# Altium schematic sheet controller.SchDoc: LV Microcontroller
size A4; Author: Samer Kilani; CompanyName: UCL; DrawnBy: Samer Kilani; Engineer: Samer Kilani; DocumentNumber: 2; Revision: 2.0; SheetNumber: 2; SheetTotal: 3
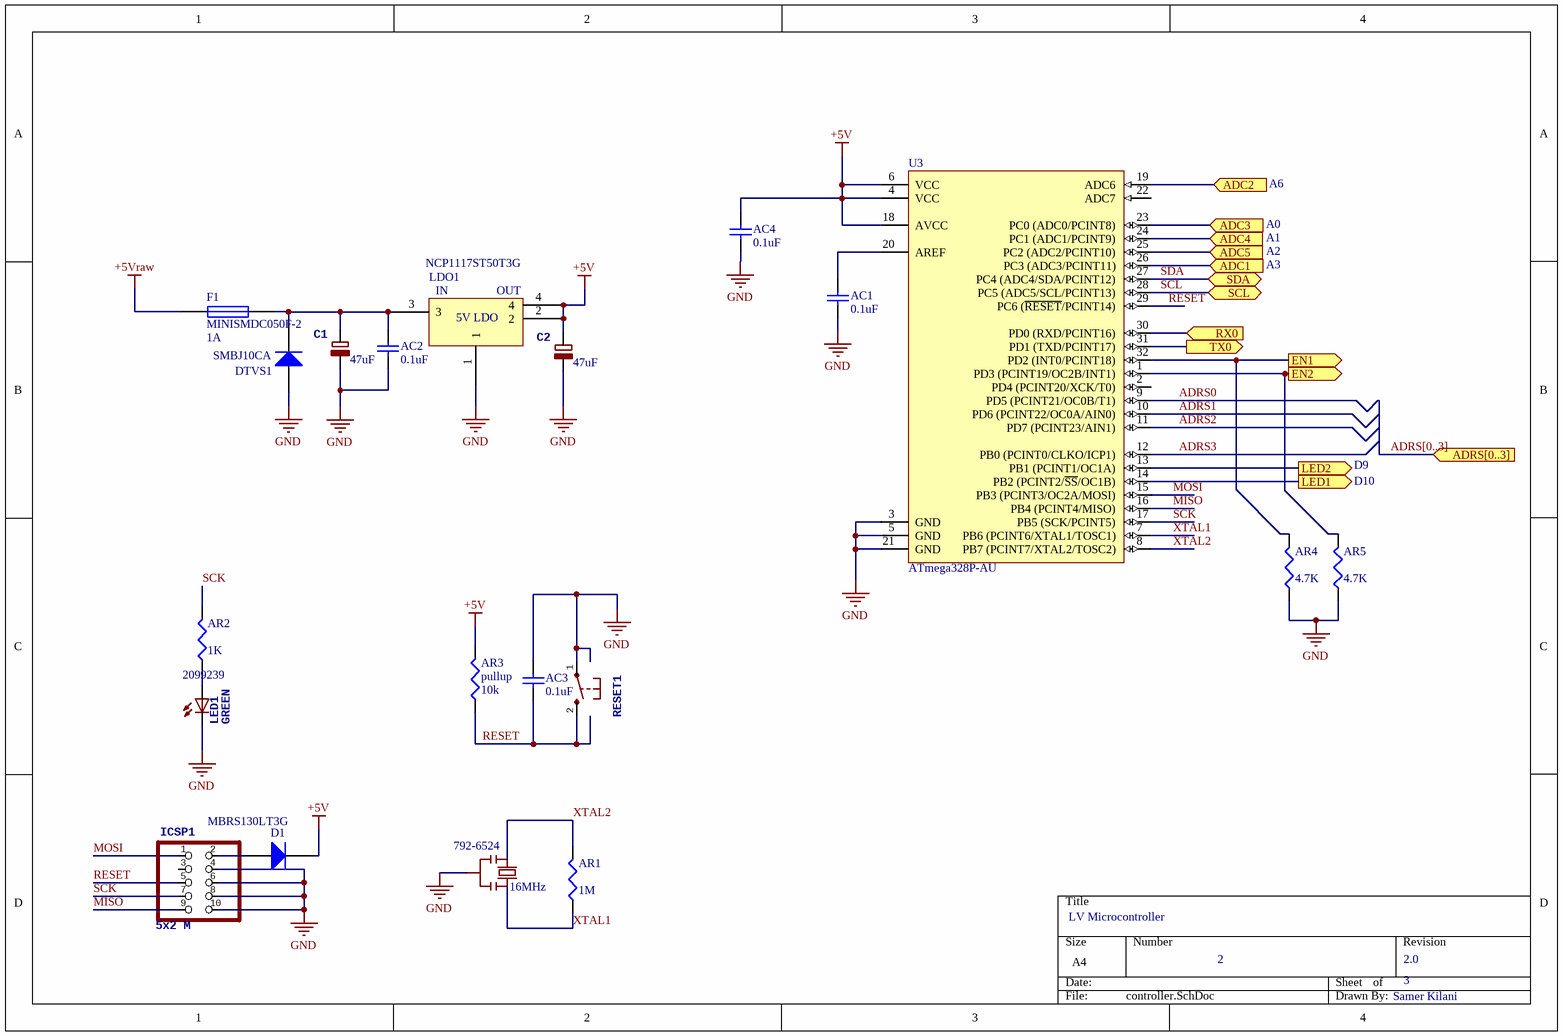
[diagram p0: controller.SchDoc]

## Parts
AC1  value 0.1uF  [1608[0603]]  (hidden comment: Cap Semi)
AC2  value 0.1uF  [1608[0603]]  (hidden comment: Cap Semi)
AC3  value 0.1uF  [1608[0603]]  (hidden comment: Cap Semi)
AC4  value 0.1uF  [1608[0603]]  (hidden comment: Cap Semi)
AR1  value 1M  [J1-0603]
AR2  value 1K  [J1-0603]
AR3  pullup  value 10k  [J1-0603]
AR4  value 4.7K  [J1-0603]
AR5  value 4.7K  [J1-0603]
C1  value 47uF  [PANASONIC_D]
C2  value 47uF  [PANASONIC_D]
D1  MBRS130LT3G  [SMB-403A]
DTVS1  SMBJ10CA  [DO-214AA]
F1  MINISMDC050F-2  Tripping current: 1A  [MF-MSMF1]
ICSP1  5x2 M  [2X05]
LDO1  PartNo: NCP1117ST50T3G  [SOT223]  (hidden comment: LDO_5V)
LED1  GREEN  Supplier Part Number 1: 2099239  [CHIP-LED0805]
RESET1  PB_RST  [1-1825027-4]  (value not drawn)
U3  ATmega328P-AU  [32A_N]
Y1  Supplier Part Number 1: 792-6524  [RESONATOR]

## Ports
ADC1 (in), ADC2 (in), ADC3 (in), ADC4 (in), ADC5 (in), ADRS[0..3] (in), EN1 (out), EN2 (out), LED1 (out), LED2 (out), RX0 (in), SCL (bidir), SDA (bidir), TX0 (out)

## Nets
+5V: AC4.2 AR3.2 C2.1 D1.1(K) LDO1.2 LDO1.4 U3.4(VCC) U3.6(VCC) U3.18(AVCC)
+5Vraw: F1.1
GND: AC1.1 AC2.1 AC3.2 AC4.1 AR4.1 AR5.1 C1.2 C2.2 DTVS1.2(A) ICSP1.4 ICSP1.6 ICSP1.8 ICSP1.10 LDO1.1 LED1.C RESET1.1 U3.3(GND) U3.5(GND) U3.21(GND) Y1.2
ADC1: U3.26(PC3_(ADC3/PCINT11)) ; port ADC1
ADC2: U3.19(ADC6) ; port ADC2
ADC3: U3.23(PC0_(ADC0/PCINT8)) ; port ADC3
ADC4: U3.24(PC1_(ADC1/PCINT9)) ; port ADC4
ADC5: U3.25(PC2_(ADC2/PCINT10)) ; port ADC5
ADRS0: U3.9(PD5_(PCINT21/OC0B/T1))
ADRS1: U3.10(PD6_(PCINT22/OC0A/AIN0))
ADRS2: U3.11(PD7_(PCINT23/AIN1))
ADRS3: U3.12(PB0_(PCINT0/CLKO/ICP1))
EN1: AR4.2 U3.32(PD2_(INT0/PCINT18)) ; port EN1
EN2: AR5.2 U3.1(PD3_(PCINT19/OC2B/INT1)) ; port EN2
LED1: U3.14(PB2_(PCINT2/~{SS}/OC1B)) ; port LED1
LED2: U3.13(PB1_(PCINT1/OC1A)) ; port LED2
MISO: ICSP1.9 U3.16(PB4_(PCINT4/MISO))
MOSI: ICSP1.1 U3.15(PB3_(PCINT3/OC2A/MOSI))
RESET: AC3.1 AR3.1 ICSP1.5 RESET1.2 U3.29(PC6_(~{RESET}/PCINT14))
RX0: U3.30(PD0_(RXD/PCINT16)) ; port RX0
SCK: AR2.2 ICSP1.7 U3.17(PB5_(SCK/PCINT5))
SCL: U3.28(PC5_(ADC5/SCL/PCINT13)) ; port SCL
SDA: U3.27(PC4_(ADC4/SDA/PCINT12)) ; port SDA
TX0: U3.31(PD1_(TXD/PCINT17)) ; port TX0
XTAL1: AR1.1 U3.7(PB6_(PCINT6/XTAL1/TOSC1)) Y1.3
XTAL2: AR1.2 U3.8(PB7_(PCINT7/XTAL2/TOSC2)) Y1.1
NetAC1_2: AC1.2 U3.20(AREF)
NetAC2_2: AC2.2 C1.1 DTVS1.1(K) F1.2 LDO1.3
NetAR2_1: AR2.1 LED1.A
NetD1_2: D1.2(A) ICSP1.2

Not connected (* = marked no-connect by the designer): ICSP1 3; U3 2(PD4_(PCINT20/XCK/T0)) 22(ADC7)

## Buses and harness runs
bus ADRS[0..3] = port ADRS[0..3]

## Notes on the sheet
- A0
- A1
- A6
- A2
- A3
- D9
- D10
- (near Y1) 16MHz
- (in symbol LDO_5V) IN; OUT; 5V LDO

## Library data of the parts
AC1-AC4 = Cap Semi: Capacitor (Semiconductor SIM Model); PartNo: CC0603KRX7R9BB104; Published: 8-Jun-2000; LatestRevisionDate: 29-May-2009; LatestRevisionNote: IPC-7351 Footprint Added.; PackageReference: C1206; Publisher: Altium Limited; PackageDescription: Chip Capacitor
AR1-AR5 = Res3: Resistor; Published: 8-Jun-2000; LatestRevisionDate: 29-May-2009; LatestRevisionNote: IPC-7351 Footprint Added.; PackageReference: J1-0603; Publisher: Altium Limited; PackageDescription: Chip Resistor
C1 C2 = CPOL-EUD: PartNo: EEE1EA470WAP
D1 = MBRS130LT3G: Power Diode; Note: Pin 2 is not connected and not drawn.; Published: 21-Mar-2003; LatestRevisionDate: 29-May-2009; LatestRevisionNote: IPC-7351 Footprint Added.; DatasheetVersion: Oct-1999; PackageVersion: Sep-2001; PackageReference: SOT-23; Publisher: Altium Limited; PackageDescription: 3-Pin SOT-23 Package 0.95 mm Pitch, 2.5 mm Lead Span; ComponentLink1Description: Manufacturer Link; ComponentLink1URL: http://www.infineon.com/; ComponentLink2Description: Datasheet; ComponentLink2URL: http://www.infineon.com/upload/Document/cmc_upload/documents/080/656/bas116series.pdf; PartNo: MBRS130LT3G
DTVS1 = SMBJ: TVS; Note: Pin 2 is not connected and not drawn.; Published: 21-Mar-2003; LatestRevisionDate: 29-May-2009; LatestRevisionNote: IPC-7351 Footprint Added.; DatasheetVersion: Oct-1999; PackageVersion: Sep-2001; PackageReference: SOT-23; Publisher: Altium Limited; PackageDescription: 3-Pin SOT-23 Package 0.95 mm Pitch, 2.5 mm Lead Span; ComponentLink1Description: Manufacturer Link; ComponentLink1URL: http://www.infineon.com/; ComponentLink2Description: Datasheet; ComponentLink2URL: http://www.infineon.com/upload/Document/cmc_upload/documents/080/656/bas116series.pdf; PartNo: SMBJ10CA
F1 = Fuse 1: Fuse; Published: 8-Jun-2000; LatestRevisionDate: 17-Jul-2002; LatestRevisionNote: Re-released for DXP Platform.; PackageReference: PIN-W2/E2.8; Publisher: Altium Limited; PackageDescription: Thru-Hole; 2 Leads; PartNo: MINISMDC050F-2
ICSP1 = PINHD-2X5: PartNo: 2-1761605-3
LED1 = LEDCHIP-LED0805: PartNo: KPT-2012SGC; Supplier 1: Farnell
U3 = ATmega328P-AU: 8-bit AVR Microcontroller, 32KB Flash, 1KB EEPROM, 2KB SRAM, 32-pin TQFP, Industrial Grade (-40°C to 85°C); DatasheetVersion: revD, May-2011; PackageVersion: revC, Oct-2010; PackageReference: 32A; PackageDescription: 32-Lead, 7x7x1.0 mm Body, 0.8mm Lead Pitch, Thin Profile Plastic Quad Flat Package (TQFP); Code_JEDEC: MS-026-ABA; ComponentLink1Description: Manufacturer URL; ComponentLink1URL: http://www.atmel.com/; ComponentLink2Description: ATmega48A/48PA/88A/88PA/168A/168PA/328/328P Datasheet; ComponentLink2URL: http://www.atmel.com/dyn/resources/prod_documents/doc8271.pdf; ComponentLink3Description: ATmega48A/48PA/88A/88PA/168A/168PA/328/328P Summary; ComponentLink3URL: http://www.atmel.com/dyn/resources/prod_documents/8271S.pdf; PartNo: ATmega328P-AU
Y1 = RESONATORMU: PartNo: CSTCE16M0V53-R0; Supplier 1: RS-Components
RESET1 = PB_RST: PartNo: 1-1825027-4